# Altium project Mega328p.PrjPcb
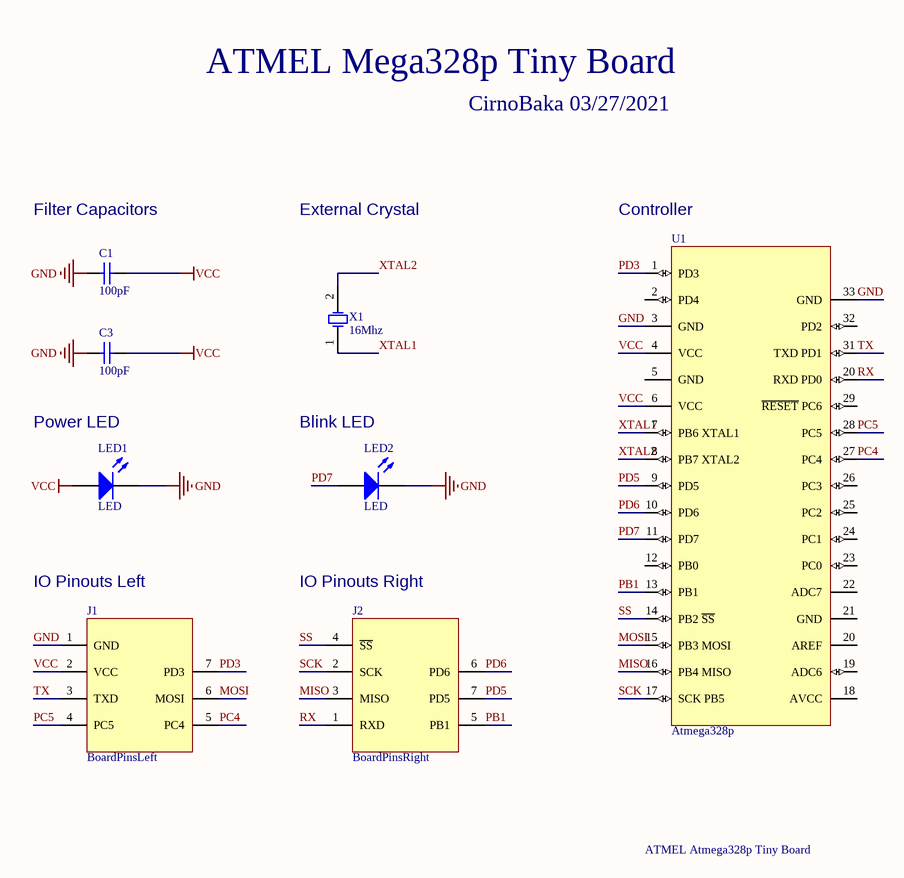
[diagram p0: Board.SchDoc]
1 sheet, 8 parts. Net scope: global (net labels, ports and power ports of the same name join across sheets).
Board file: Board.PcbDoc

## Sheet Board.SchDoc
size A

### Parts
C1  100pF  [C0402]
C3  100pF  [C0402]
J1  BoardPinsLeft  [Connector7G]
J2  BoardPinsRight  [Connector7]
LED1  LED  [LED0402]
LED2  LED  [LED0402]
U1  Atmega328p  [Atmega328p]
X1  16Mhz  [CSTCE16M0V53-RO]

### Nets
GND: C1.1 C3.1 J1.1(GND) LED1.2(K) LED2.2(K) U1.3(GND) U1.33(GND)
VCC: C1.2 C3.2 J1.2(VCC) LED1.1(A) U1.4(VCC) U1.6(VCC)
MISO: J2.3(MISO) U1.16(PB4_MISO)
MOSI: J1.6(MOSI) U1.15(PB3_MOSI)
PB1: J2.5(PB1) U1.13(PB1)
PC4: J1.5(PC4) U1.27(PC4)
PC5: J1.4(PC5) U1.28(PC5)
PD3: J1.7(PD3) U1.1(PD3)
PD5: J2.7(PD5) U1.9(PD5)
PD6: J2.6(PD6) U1.10(PD6)
PD7: LED2.1(A) U1.11(PD7)
RX: J2.1(RXD) U1.20(AREF)
SCK: J2.2(SCK) U1.17(SCK_PB5)
SS: J2.4(~{SS}) U1.14(PB2_~{SS})
TX: J1.3(TXD) U1.31(TXD_PD1)
XTAL1: U1.7(PB6_XTAL1) X1.1(OSC1)
XTAL2: U1.8(PB7_XTAL2) X1.2(OSC2)

Not connected (* = marked no-connect by the designer): U1 2(PD4) 5(GND) 12(PB0) 18(AVCC) 19(ADC6) 21(GND) 22(ADC7) 23(PC0) 24(PC1) 25(PC2) 26(PC3) 29(~{RESET}_PC6) 32(PD2)

### Notes on the sheet
- CirnoBaka 03/27/2021
- ATMEL Mega328p Tiny Board
- (near C1) Filter Capacitors
- External Crystal
- (near U1) Controller
- Power LED
- (near LED2) Blink LED
- (near J1) IO Pinouts Left
- (near J2) IO Pinouts Right
- ATMEL Atmega328p Tiny Board

### Library data of the parts
C1 C3 = Capacitor
X1 = Crystal